# Altium schematic sheet Relay control schematic.SchDoc
size A; SheetNumber: 1; SheetTotal: 1
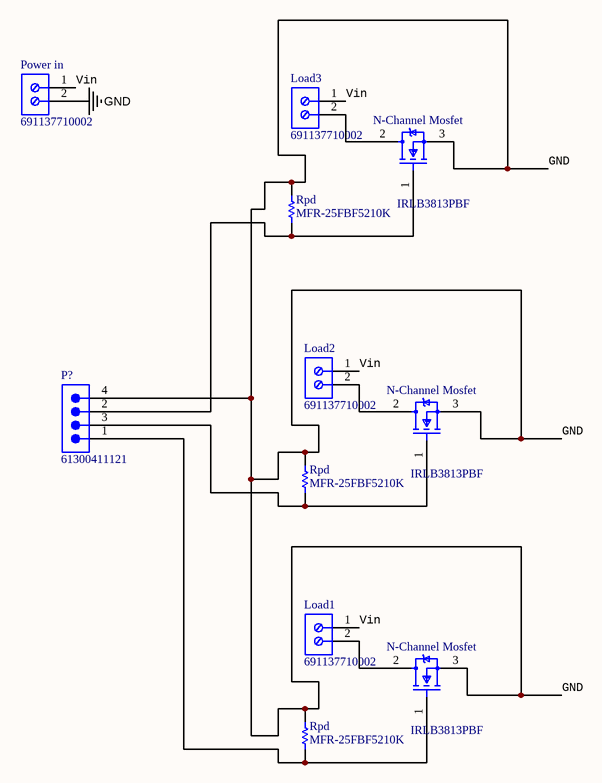
[diagram p0: Relay control schematic.SchDoc]

## Parts
(Parts that share a designator on the sheet are numbered #1, #2 ... from top to bottom, then left to right.)
Load1  691137710002  [691137710002]
Load2  691137710002  [691137710002]
Load3  691137710002  [691137710002]
N-Channel_Mosfet#1  IRLB3813PBF  [FP-PG-TO220-3-MFG]
N-Channel_Mosfet#2  IRLB3813PBF  [FP-PG-TO220-3-MFG]
N-Channel_Mosfet#3  IRLB3813PBF  [FP-PG-TO220-3-MFG]
P?  61300411121  [61300411121]
Power_in  691137710002  [691137710002]
Rpd#1  MFR-25FBF5210K  [RESA60-630X240]
Rpd#2  MFR-25FBF5210K  [RESA60-630X240]
Rpd#3  MFR-25FBF5210K  [RESA60-630X240]

## Nets
GND: N-Channel_Mosfet#1.3(S) N-Channel_Mosfet#2.3(S) N-Channel_Mosfet#3.3(S) P?.4 Power_in.2 Rpd#1.2 Rpd#2.2 Rpd#3.2
Vin: Load1.1 Load2.1 Load3.1 Power_in.1
NetLoad1_2: Load1.2 N-Channel_Mosfet#3.2(D)
NetLoad2_2: Load2.2 N-Channel_Mosfet#2.2(D)
NetLoad3_2: Load3.2 N-Channel_Mosfet#1.2(D)
NetN-Channel_Mosfet#1_1: N-Channel_Mosfet#1.1(G) P?.2 Rpd#1.1
NetN-Channel_Mosfet#2_1: N-Channel_Mosfet#2.1(G) P?.3 Rpd#2.1
NetN-Channel_Mosfet#3_1: N-Channel_Mosfet#3.1(G) P?.1 Rpd#3.1

## Library data of the parts
Load1-Load3 Power_in = CMP-1502-03324-2: NexarPartId: 78871135; Voltage Rating: 300V; Number of Contacts: 2; Current Rating: 16A; Lead Pitch: 5mm; Height: 11.6mm; Packaging: Box; RoHS: Non-Compliant; Contact Material: Nickel, Tin; Max Operating Temperature: 120°C; Number of Pins: 2; Min Operating Temperature: -30°C; Number of Rows: 1
N-Channel_Mosfet#1-N-Channel_Mosfet#3 = CMP-32901-000118-1: MOSFET N-CH 30V 260A TO-220AB; Manufacturer: Infineon; Threshold Vgs Max: 2.35V; Gate To Source Voltage: 20V; Number Of N Channels: 1; Threshold Vgs Min: 1.35V; Gate Charge At Vgs: 57nC @ 4.5V; Depletion Mode: False; Max Junction Temp: +175°C; Standoff Height: 3.37mm; Input Capacitace At Vds: 8420pF @ 15V; Reverse Recovery Charge: 22nC; Drain To Source Resistance: 2mΩ; Reverse Recovery Time: 24ns; Pulse Drain Current: 1050A; Turn Off Delay Time: 33ns; Description: N-Channel 30V 260A (Tc) 230W (Tc) Through Hole TO-220AB; Turn On Delay Time: 36ns; Rthja Max: 62°C/W; Max Forward Diode Voltage: 1V; Power Dissipation: 230W; Digikey Description: MOSFET N-CH 30V 260A TO-220AB; Device Class L2: Transistors; Device Class L3: MOSFETs; Device Class L1: Discrete Semiconductors; Footprint Url: https://www.infineon.com/dgdl/po-to220ab-fp.pdf?fileId=5546d462580663ef0158068cfbee01be; ComponentLink2Description: Datasheet; Continuous Drain Current: 260A; Drain To Source Voltage: 30V; Temperature: -55°C to +175°C; Temperature Range Low: -55°C; Octopart: https://octopart.com/irlb3813pbf-infineon-65874923; Number Of Channels: 1; Drain To Source Breakdown Voltage: 30V; Height: 19.8mm; Temperature Range High: +175°C; RoHS: TRUE; Automotive: No; Category: Trans; ComponentLink2URL: https://www.infineon.com/dgdl/irlb3813pbf.pdf?fileId=5546d462533600a4015356603cfe258b; Manufacturer Part Number: IRLB3813PBF; Package: PG-TO220-3; Lead Free: Yes
P? = CMP-1502-01064-3: NexarPartId: 32855522; Operating Supply Voltage: 250V; Pitch: 2.54mm; Contact Resistance: 20mΩ; Number of Positions: 4; Current Rating: 3A; Connector Type: Male Pin; Gender: Male; Contact Plating: Gold; Height: 8.89mm; Lead Pitch: 2.54mm; Lead Free: Lead Free; Contact Mating Length: 5.9944mm; Number of Rows: 1; Termination: Solder; Packaging: Bulk; REACH SVHC: Unknown; Min Operating Temperature: -40°C; RoHS: Compliant; Number of Contacts: 4; Voltage Rating: 250V; Color: Black; Max Operating Temperature: 105°C; Contact Material: Copper; Mount: Through Hole; Orientation: Vertical; Number of Pins: 4
Rpd#1-Rpd#3 = CMP-1659-00074-2: Axial Resistor, 10 KOhm, +/- 1%, 0.25 W, -55 to 155 degC, 2-Pin THD, RoHS, Bulk; Manufacturer: Yageo; Temperature Coefficient: 100ppm\/degreesC; Voltage Rating: 250V; Voltage Rating (DC): 200V; Resistance: 10KOhm; Max Power Dissipation: 250mW; Datasheet URL: http://www.yageo.com/documents/recent/Yageo%20LR_MFR_2013.pdf; Packaging: Bulk; RoHSCompliant: True; Mount: ThroughHole; Package Reference: MFR-25; Termination: Axial; Composition: MetalFilm; Number of Terminations: 2; Package Quantity: 200; Mounting Technology: ThroughHole; Length: 0.248inch; Max Operating Temperature: 155degC; Min Operating Temperature: -55degC; Datasheet Version: 04/2013; Lead Free: LeadFree; Manufacturer URL: http://www.yageo.com/; Tolerance: 1%; Power Rating: 250mW; Package Description: 2-Pin Axial Lead, Dia 2.4 mm, Body Length 6.3 mm; Military Standard: Not; Case\/Package: Axial